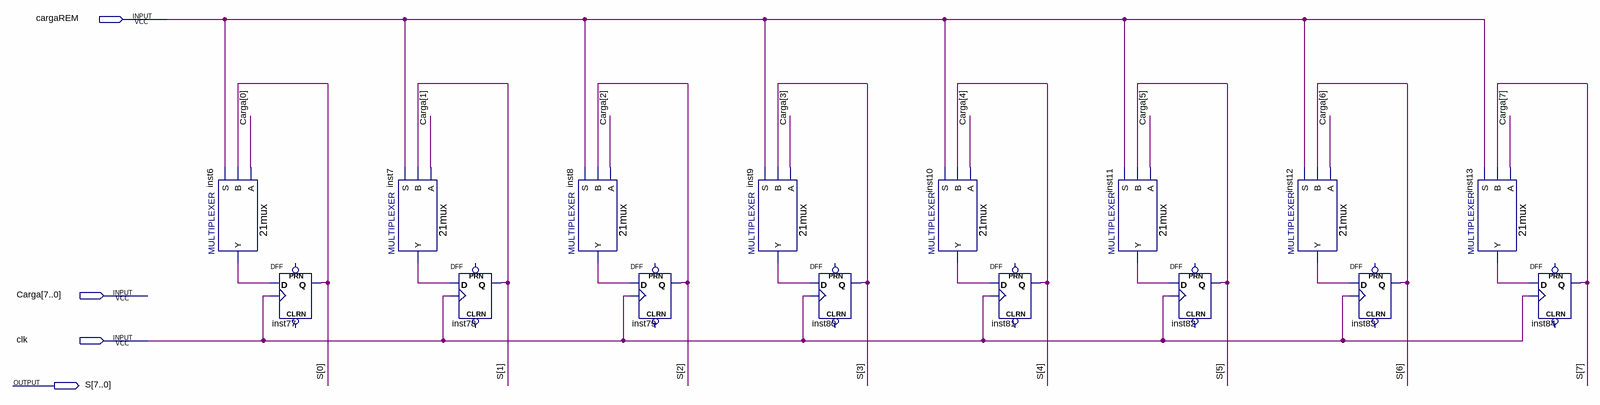
[diagram p0: schematic sheet]
// Quartus schematic REM.bdf as structural Verilog: 16 symbols, 4 pins
module REM (
  input  cargaREM,
  input  [7:0] Carga,
  input  clk,
  output [7:0] S
);

  wire inst6_y, inst7_y, inst8_y, inst9_y, inst10_y, inst11_y, inst12_y, inst13_y;

  \21mux  inst6 (.S(cargaREM), .B(S[0]), .A(Carga[0]), .Y(inst6_y));
  DFF inst77 (.CLK(clk), .D(inst6_y), .Q(S[0]));  // open: CLRN, PRN
  \21mux  inst7 (.S(cargaREM), .B(S[1]), .A(Carga[1]), .Y(inst7_y));
  DFF inst78 (.CLK(clk), .D(inst7_y), .Q(S[1]));  // open: CLRN, PRN
  \21mux  inst8 (.S(cargaREM), .B(S[2]), .A(Carga[2]), .Y(inst8_y));
  DFF inst79 (.CLK(clk), .D(inst8_y), .Q(S[2]));  // open: CLRN, PRN
  \21mux  inst9 (.S(cargaREM), .B(S[3]), .A(Carga[3]), .Y(inst9_y));
  DFF inst80 (.CLK(clk), .D(inst9_y), .Q(S[3]));  // open: CLRN, PRN
  \21mux  inst10 (.S(cargaREM), .B(S[4]), .A(Carga[4]), .Y(inst10_y));
  DFF inst81 (.CLK(clk), .D(inst10_y), .Q(S[4]));  // open: CLRN, PRN
  \21mux  inst11 (.S(cargaREM), .B(S[5]), .A(Carga[5]), .Y(inst11_y));
  DFF inst82 (.CLK(clk), .D(inst11_y), .Q(S[5]));  // open: CLRN, PRN
  \21mux  inst12 (.S(cargaREM), .B(S[6]), .A(Carga[6]), .Y(inst12_y));
  DFF inst83 (.CLK(clk), .D(inst12_y), .Q(S[6]));  // open: CLRN, PRN
  \21mux  inst13 (.S(cargaREM), .B(S[7]), .A(Carga[7]), .Y(inst13_y));
  DFF inst84 (.CLK(clk), .D(inst13_y), .Q(S[7]));  // open: CLRN, PRN
endmodule
